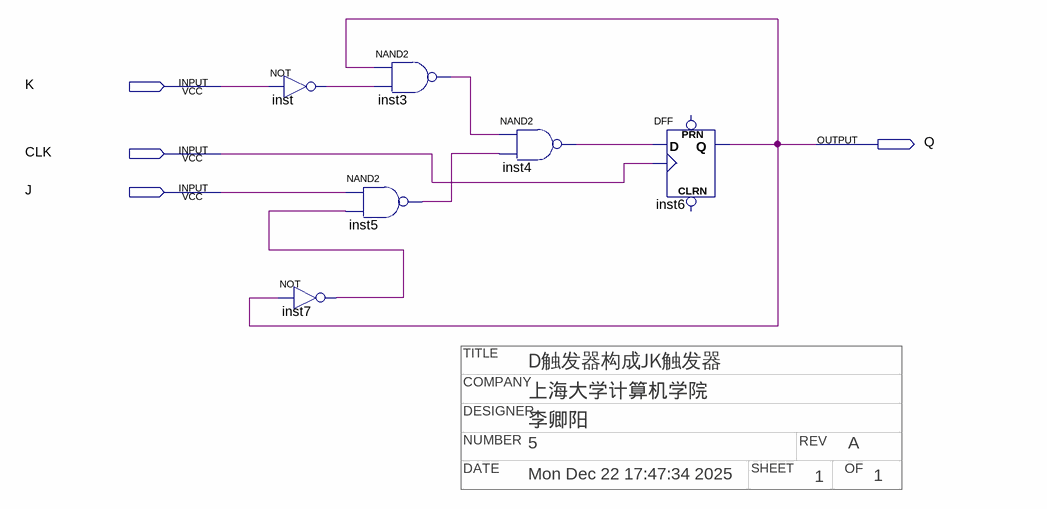
[diagram p0: schematic sheet]
// Quartus schematic w5.bdf as structural Verilog: 6 symbols, 4 pins
// Title block: TITLE: D触发器构成JK触发器; COMPANY: 上海大学计算机学院; DESIGNER: 李卿阳; NUMBER: 5; REV: A; DATE: Mon Dec 22 17:47:34 2025; SHEET: 1; OF: 1
module w5 (
  input  K,
  input  CLK,
  input  J,
  output Q
);

  wire inst3_out, inst4_out, inst5_out, inst7_out, inst_out;

  not inst (inst_out, K);
  not inst7 (inst7_out, Q);
  nand inst3 (inst3_out, Q, inst_out);
  nand inst5 (inst5_out, J, inst7_out);
  nand inst4 (inst4_out, inst3_out, inst5_out);
  DFF inst6 (.CLK(CLK), .D(inst4_out), .Q(Q));  // open: CLRN, PRN
endmodule
